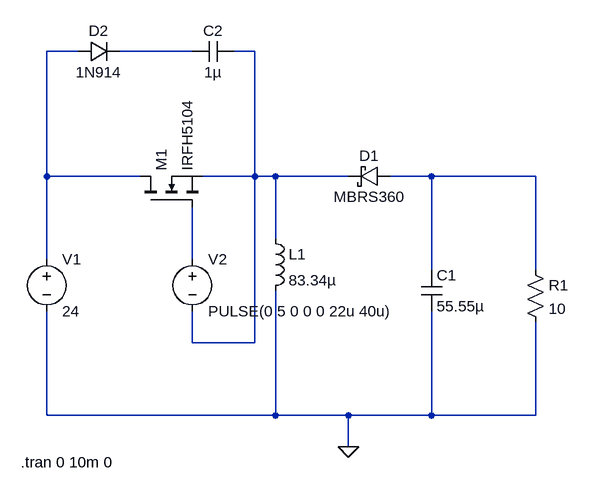
[diagram p0: schematic buckboostcon.asc]
buckboostcon.asc, the LTspice schematic file:
Version 4
SHEET 1 1144 680
WIRE 384 -80 336 -80
WIRE 560 -80 448 -80
WIRE 656 -80 624 -80
WIRE 336 112 336 -80
WIRE 480 112 336 112
WIRE 656 112 656 -80
WIRE 656 112 576 112
WIRE 688 112 656 112
WIRE 800 112 688 112
WIRE 928 112 864 112
WIRE 1088 112 928 112
WIRE 688 208 688 112
WIRE 336 240 336 112
WIRE 560 240 560 160
WIRE 928 256 928 112
WIRE 1088 256 1088 112
WIRE 560 368 560 320
WIRE 656 368 656 112
WIRE 656 368 560 368
WIRE 336 480 336 320
WIRE 688 480 688 288
WIRE 688 480 336 480
WIRE 800 480 688 480
WIRE 928 480 928 320
WIRE 928 480 800 480
WIRE 1088 480 1088 336
WIRE 1088 480 928 480
WIRE 800 528 800 480
FLAG 800 528 0
SYMBOL res 1072 240 R0
SYMATTR InstName R1
SYMATTR Value 10
SYMBOL cap 912 256 R0
SYMATTR InstName C1
SYMATTR Value 55.55µ
SYMBOL ind 672 192 R0
SYMATTR InstName L1
SYMATTR Value 83.34µ
SYMBOL schottky 864 96 R90
WINDOW 0 0 32 VBottom 2
WINDOW 3 32 32 VTop 2
SYMATTR InstName D1
SYMATTR Value MBRS360
SYMBOL voltage 336 224 R0
WINDOW 123 0 0 Left 0
WINDOW 39 0 0 Left 0
SYMATTR InstName V1
SYMATTR Value 24
SYMBOL nmos 480 160 R270
SYMATTR InstName M1
SYMATTR Value IRFH5104
SYMBOL diode 384 -64 R270
WINDOW 0 32 32 VTop 2
WINDOW 3 0 32 VBottom 2
SYMATTR InstName D2
SYMATTR Value 1N914
SYMBOL cap 624 -96 R90
WINDOW 0 0 32 VBottom 2
WINDOW 3 32 32 VTop 2
SYMATTR InstName C2
SYMATTR Value 1µ
SYMBOL voltage 560 224 R0
WINDOW 123 0 0 Left 0
WINDOW 39 0 0 Left 0
SYMATTR InstName V2
SYMATTR Value PULSE(0 5 0 0 0 22u 40u)
TEXT 296 552 Left 2 !.tran 0 10m 0

The netlist it stands for:
* buckboostcon.asc
R1 N004 0 10
C1 N004 0 55.55µ
L1 N003 0 83.34µ
D1 N004 N003 MBRS360
V1 N001 0 24
M1 N001 N005 N003 N003 IRFH5104
D2 N001 N002 1N914
C2 N003 N002 1µ
V2 N005 N003 PULSE(0 5 0 0 0 22u 40u)
.model D D
.lib standard.dio
.model NMOS NMOS
.model PMOS PMOS
.lib standard.mos
.tran 0 10m 0
.backanno
.end